# Altium schematic sheet audio.SchDoc
size B
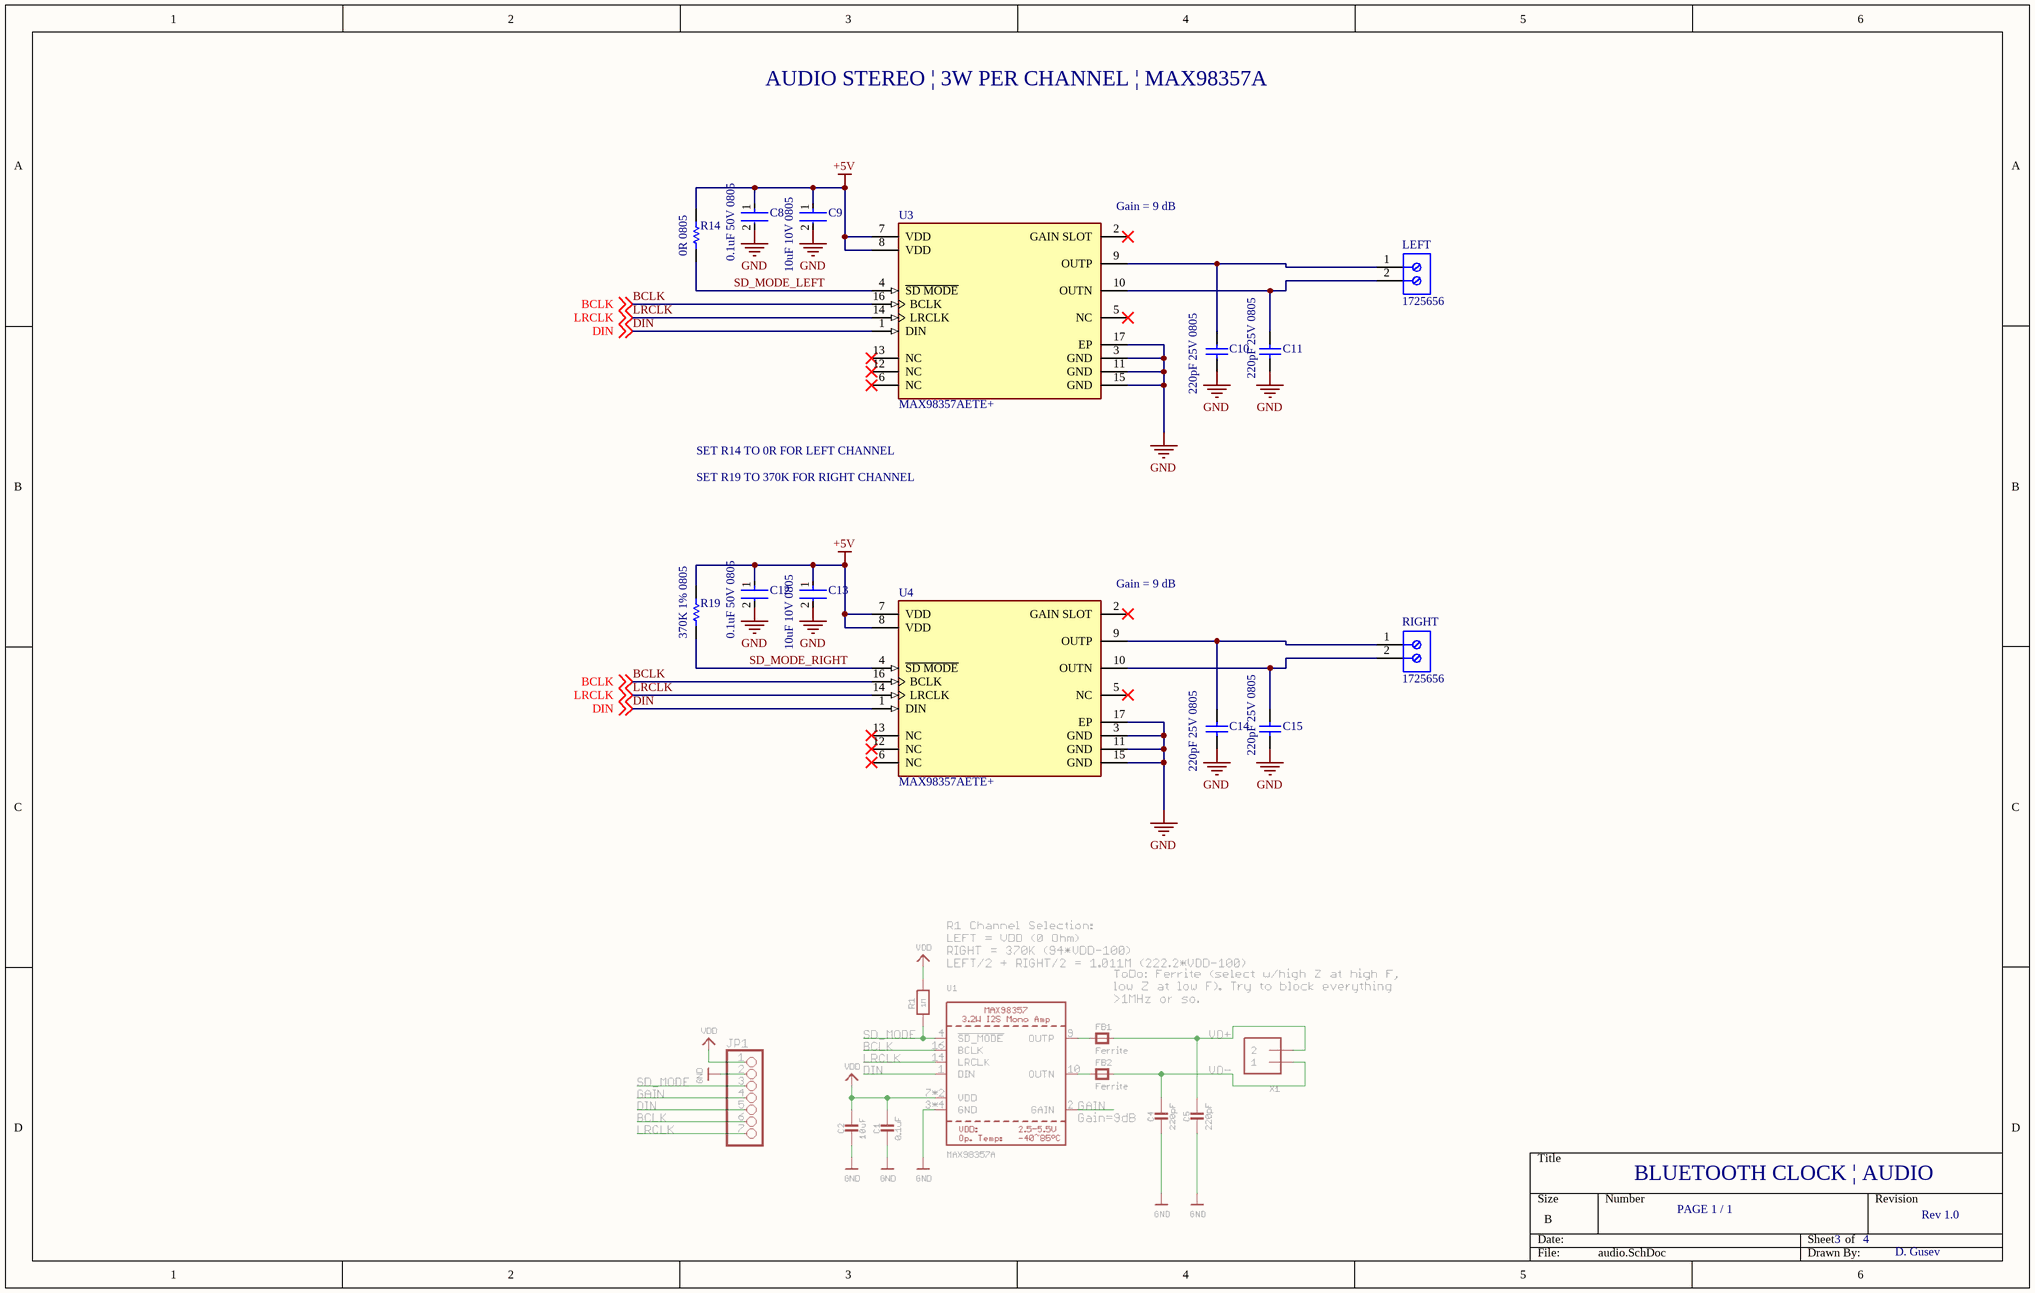
[diagram p0: audio.SchDoc]

## Parts
C8  0.1uF 50V 0805  [FP-C0805C-DN-MFG]
C9  10uF 10V 0805  [FP-C0805C-DG-MFG]
C10  220pF 25V 0805  [CAPC2013X94X50LL20T25]
C11  220pF 25V 0805  [CAPC2013X94X50LL20T25]
C12  0.1uF 50V 0805  [FP-C0805C-DN-MFG]
C13  10uF 10V 0805  [FP-C0805C-DG-MFG]
C14  220pF 25V 0805  [CAPC2013X94X50LL20T25]
C15  220pF 25V 0805  [CAPC2013X94X50LL20T25]
LEFT  1725656  [PHOE-1725656-2]
R14  0R 0805  [RESC2013X60X35NL10T20]
R19  370K 1% 0805  [RESC2013X60X35NL10T20]
RIGHT  1725656  [PHOE-1725656-2]
U3  MAX98357AETE+  [FP-T1633-4-MFG]
U4  MAX98357AETE+  [FP-T1633-4-MFG]

## Nets
+5V: C8.1 C9.1 C12.1 C13.1 R14.2 R19.2 U3.7(VDD) U3.8(VDD) U4.7(VDD) U4.8(VDD)
GND: C8.2 C9.2 C10.1 C11.1 C12.2 C13.2 C14.1 C15.1 U3.3(GND) U3.11(GND) U3.15(GND) U3.17(EP) U4.3(GND) U4.11(GND) U4.15(GND) U4.17(EP)
BCLK: U3.16(BCLK) U4.16(BCLK) ; off-sheet BCLK
DIN: U3.1(DIN) U4.1(DIN) ; off-sheet DIN
LRCLK: U3.14(LRCLK) U4.14(LRCLK) ; off-sheet LRCLK
SD_MODE_LEFT: R14.1 U3.4(~{SD_MODE})
SD_MODE_RIGHT: R19.1 U4.4(~{SD_MODE})
NetC10_2: C10.2 LEFT.1 U3.9(OUTP)
NetC11_2: C11.2 LEFT.2 U3.10(OUTN)
NetC14_2: C14.2 RIGHT.1 U4.9(OUTP)
NetC15_2: C15.2 RIGHT.2 U4.10(OUTN)

Not connected (* = marked no-connect by the designer): U3 2(GAIN_SLOT)* 5(NC)* 6(NC)* 12(NC)* 13(NC)*; U4 2(GAIN_SLOT)* 5(NC)* 6(NC)* 12(NC)* 13(NC)*

## Notes on the sheet
- AUDIO STEREO | 3W PER CHANNEL | MAX98357A
- (near U3) Gain = 9 dB
- SET R14 TO 0R FOR LEFT CHANNEL
- SET R19 TO 370K FOR RIGHT CHANNEL
- (near U4) Gain = 9 dB
- BLUETOOTH CLOCK | AUDIO
- PAGE 1 / 1
- 3
- 4
- Rev 1.0
- D. Gusev

## Library data of the parts
C8 C12 = CMP-2007-00279-2: CAP CER 0.1UF 50V X7R 0805; Manufacturer Part Number: C0805C104K5RACTU; Manufacturer: KEMET; Value: 0.10 μF; Tolerance: 0.1; Temperature Coefficient: 30ppm/°C; Material: Ceramic; Device Class L2: Capacitors; Temperature Range Low: -55°C; Voltage Rating: 50 V; Digikey Description: CAP CER 0.1UF 50V X7R 0805; Category: Cap; ComponentLink2Description: Datasheet; Octopart: https://octopart.com/c0805c104k5ractu-kemet-143926; RoHS: TRUE; ComponentLink2URL: https://content.kemet.com/datasheets/KEM_C1003_C0G_SMD.pdf; Temperature Characteristic: X7R; Temperature: -55°C to +125°C; Height: 0.88mm; Temperature Range High: +125°C; Device Class L1: Passive Components; Automotive: No; Lead Free: Yes; Ipc Land Pattern Name: CAPC200125X78; Device Class L3: Ceramic Capacitors; Mouser Description: Cap Ceramic 0.1uF 50V X7R 10% SMD 2.0 x 1.2 mm 125 C Paper T/R; Capacitance: 0.10 μF; Package: C0805C-DN
C9 C13 = CMP-2007-03243-2: CAP CER 10UF 10V X5R 0805; Manufacturer Part Number: C0805C106K8PACTU; Manufacturer: Kemet; 3DS Part Number: 220-00001; Tolerance: 10%; Temperature Coefficient: 15%; Material: Ceramic; Device Class L2: Capacitors; Device Class L1: Passive Components; ComponentLink2URL: https://content.kemet.com/datasheets/KEM_C1006_X5R_SMD.pdf; Height: 1.4mm; Lead Free: Yes; Digikey Description: CAP CER 10UF 10V X5R 0805; Octopart: https://octopart.com/c0805c106k8pactu-kemet-98697; Capacitance: 10uF; Value: 10uF; Temperature Range Low: -55°C; Temperature: -55°C to +85°C; Automotive: No; Mouser Description: CAP CER 10UF 10V X5R 0805; Ipc Land Pattern Name: CAPC200125X125; Temperature Range High: +85°C; Voltage: 10V; RoHS: TRUE; Device Class L3: Ceramic Capacitors; ComponentLink2Description: Datasheet; Voltage Rating: 10V; Package: C0805C-DG; Temperature Characteristic: X5R; Category: Cap
C10 C11 C14 C15 = CMP-2007-04219-1: Manufacturer: AVX Interconnect / Elco; Part Number: 08053A221JAT2A
LEFT RIGHT = CMP-2000-05299-1: Male Header, Pitch 2.54 mm, 1 x 2 Position, Height 9 mm, Tail Length 3.5 mm; Manufacturer: Phoenix Contact; Number of contacts: 2; Content: 250pc(s); Pitch: 2.54mm; Industrial packaging: Yes; Colour: Green; Manufacturer part No.: 1725656; Type: MPT0,5/2-2,54; Datasheet URL: http://datasheet.octopart.com/1725656-Phoenix-Contact-datasheet-5302866.pdf; Manufacturer URL: http://www.phoenixcontact.com/; Datasheet Version: Apr-08
R14 R19 = CMP-2001-01791-1: Part Number: RV0805FR-071ML; Manufacturer: Yageo
U3 U4 = CMP-05698-000004-1: IC AMP CLASS D MONO 3.2W 16TQFN; Supply Type: Single; Load Impedance: 4R; Power Supply Rejection Ratio (PSRR): 77dB; Gain: 15dB; Max Supply Voltage: 5.5V; Operating Supply Voltage: 5V; Max Power Dissipation: 1.666W; Max Output Current: 1.6A; Min Supply Voltage: 2.5V; Operating Supply Current: 2.75mA; Number of Channels: 1; Max Operating Temperature: 85°C; Number of Pins: 16; Mount: Surface Mount; Package Quantity: 490; Packaging: Rail/Tube; Min Operating Temperature: -40°C; Voltage Gain: 15dB; Max Output Power: 3.2W; Output Power: 3.2W; Contact Plating: Tin; Radiation Hardening: No